# Altium schematic sheet 08-DcMotorEncoder.SchDoc
size A4
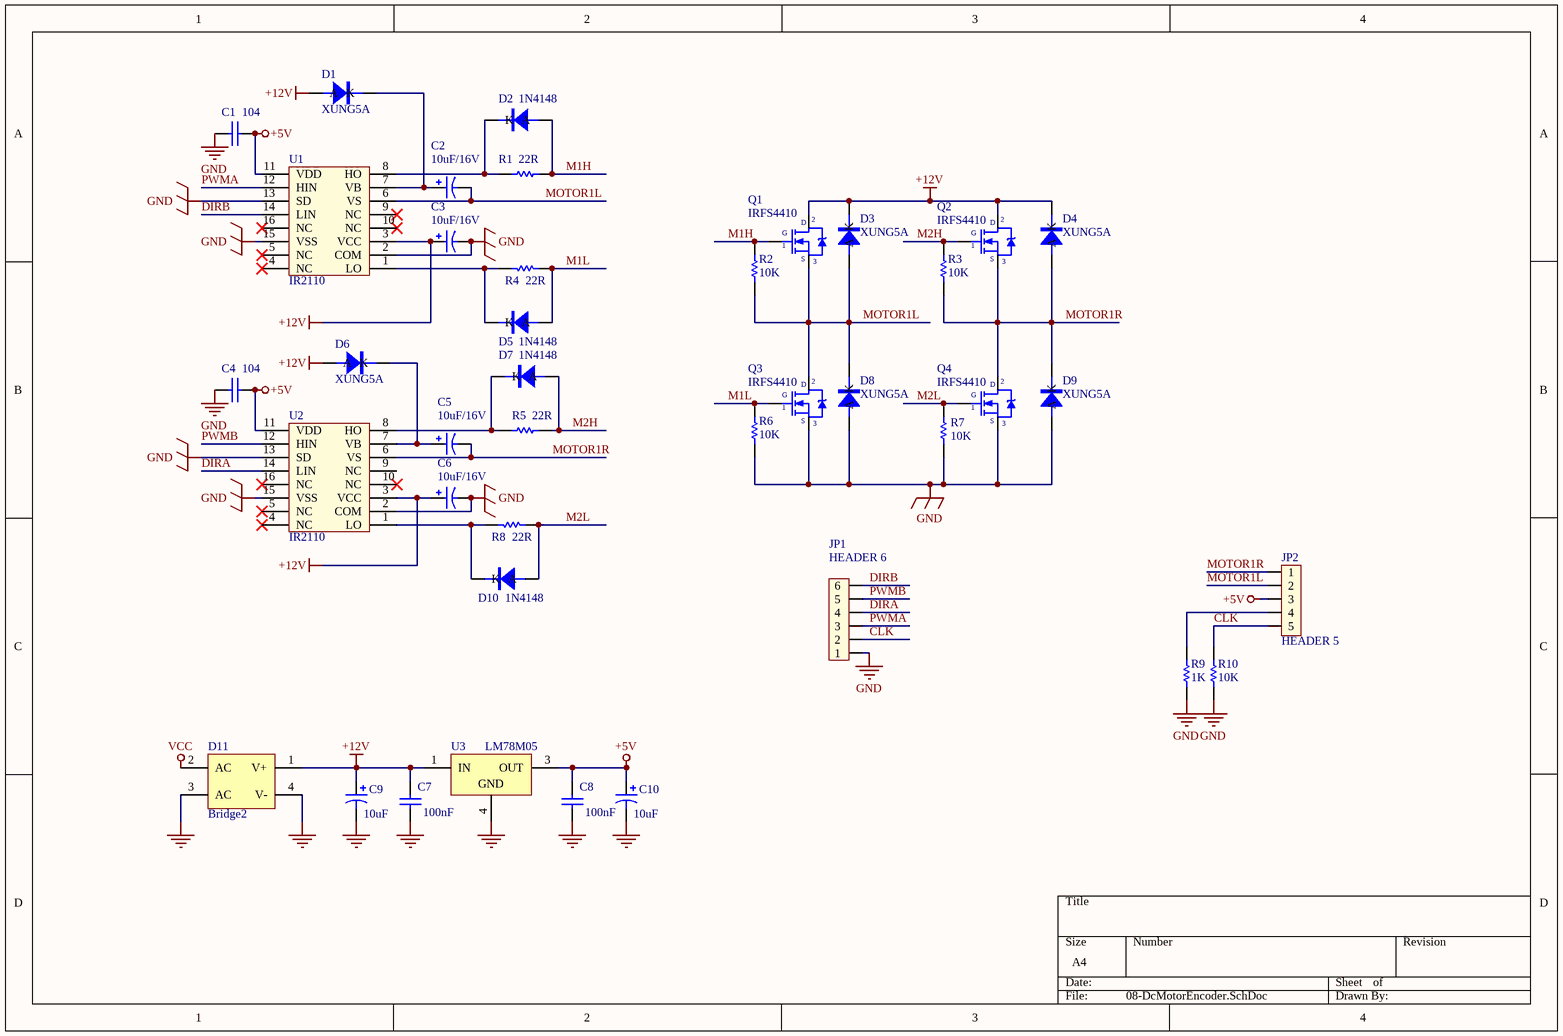
[diagram p0: 08-DcMotorEncoder.SchDoc]

## Parts
C1  104  [R-0805]
C2  value 10uF/16V  [C-TANT-1210]  (hidden comment: 10U16V)
C3  value 10uF/16V  [C-TANT-1210]  (hidden comment: 10U16V)
C4  104  [R-0805]
C5  value 10uF/16V  [C-TANT-1210]  (hidden comment: 10U16V)
C6  value 10uF/16V  [C-TANT-1210]  (hidden comment: 10U16V)
C7  value 100nF  [RAD-0.3]  (hidden comment: 104)
C8  value 100nF  [RAD-0.3]  (hidden comment: 104)
C9  value 10uF  [RB7.6-15]  (hidden comment: 10uF/16V)
C10  value 10uF  [RB7.6-15]  (hidden comment: 10uF/16V)
D1  value XUNG5A  [D-DO214-AC]  (hidden comment: 1N4007)
D2  1N4148  [D-DO213-AA]
D3  value XUNG5A  [D-DO214-AC]  (hidden comment: 1N4007)
D4  value XUNG5A  [D-DO214-AC]  (hidden comment: 1N4007)
D5  1N4148  [D-DO213-AA]
D6  value XUNG5A  [D-DO214-AC]  (hidden comment: 1N4007)
D7  1N4148  [D-DO213-AA]
D8  value XUNG5A  [D-DO214-AC]  (hidden comment: 1N4007)
D9  value XUNG5A  [D-DO214-AC]  (hidden comment: 1N4007)
D10  1N4148  [D-DO213-AA]
D11  Bridge2  [D-46_6A]
JP1  HEADER 6  [JP6]
JP2  HEADER 5  [CONN-XH2.54-5P]
Q1  IRFS4410  [TO-263-3]
Q2  IRFS4410  [TO-263-3]
Q3  IRFS4410  [TO-263-3]
Q4  IRFS4410  [TO-263-3]
R1  value 22R  [R-0805]  (hidden comment: 22)
R2  10K  [R-0805]
R3  10K  [R-0805]
R4  value 22R  [R-0805]  (hidden comment: 22)
R5  value 22R  [R-0805]  (hidden comment: 22)
R6  10K  [R-0805]
R7  10K  [R-0805]
R8  value 22R  [R-0805]  (hidden comment: 22)
R9  1K  [R-0805]
R10  value 10K  [R-0805]  (hidden comment: 1K)
U1  IR2110  [SOIC-16-W]
U2  IR2110  [SOIC-16-W]
U3  value LM78M05  [NDP0003B_M]  (hidden comment: LM78M05CDTX)

## Nets
+5V: C1.2 C4.2 C8.1 C10.1 JP2.3 U1.11(VDD) U2.11(VDD) U3.3(OUT)
+12V: C3.1 C6.1 C7.1 C9.1 D1.1(A) D3.2(K) D4.2(K) D6.1(A) D11.1(V+) Q1.2(D) Q2.2(D) U1.3(VCC) U2.3(VCC) U3.1(IN)
GND: C1.1 C3.2 C4.1 C6.2 C7.2 C8.2 C9.2 C10.2 D8.1(A) D9.1(A) D11.3(AC) D11.4(V-) JP1.1 Q3.3(S) Q4.3(S) R6.1 R7.1 R9.1 R10.1 U1.2(COM) U1.13(SD) U1.15(VSS) U2.2(COM) U2.13(SD) U2.15(VSS) U3.4(GND)
VCC: D11.2(AC)
CLK: JP1.2 JP2.5 R10.2
DIRA: JP1.4 U2.14(LIN)
DIRB: JP1.6 U1.14(LIN)
M1H: D2.1(A) Q1.1(G) R1.2 R2.2
M1L: D5.1(A) Q3.1(G) R4.2 R6.2
M2H: D7.1(A) Q2.1(G) R3.2 R5.2
M2L: D10.1(A) Q4.1(G) R7.2 R8.2
MOTOR1L: C2.2 D3.1(A) D8.2(K) JP2.2 Q1.3(S) Q3.2(D) R2.1 U1.6(VS)
MOTOR1R: C5.2 D4.1(A) D9.2(K) JP2.1 Q2.3(S) Q4.2(D) R3.1 U2.6(VS)
PWMA: JP1.3 U1.12(HIN)
PWMB: JP1.5 U2.12(HIN)
NetC2_1: C2.1 D1.2(K) U1.7(VB)
NetC5_1: C5.1 D6.2(K) U2.7(VB)
NetD2_2: D2.2(K) R1.1 U1.8(HO)
NetD5_2: D5.2(K) R4.1 U1.1(LO)
NetD7_2: D7.2(K) R5.1 U2.8(HO)
NetD10_2: D10.2(K) R8.1 U2.1(LO)
NetJP2_4: JP2.4 R9.2

Not connected (* = marked no-connect by the designer): U1 4(NC)* 5(NC)* 9(NC)* 10(NC)* 16(NC)*; U2 4(NC)* 5(NC)* 9(NC) 10(NC)* 16(NC)*

## Library data of the parts
C1 C4 = CAP NP: value: 104
C2 C3 C5 C6 = CAP POL
C7 C8 = Cap: Capacitor; Published: 8-Jun-2000; LatestRevisionDate: 17-Jul-2002; LatestRevisionNote: Re-released for DXP Platform.; PackageReference: RAD-0.3; Publisher: Altium Limited; PackageDescription: Radial Cap, Thru-Hole; 2 Leads; 0.3 in Pin Spacing
C9 C10 = Cap Pol1: Polarized Capacitor (Radial); Published: 8-Jun-2000; LatestRevisionDate: 17-Jul-2002; LatestRevisionNote: Re-released for DXP Platform.; PackageReference: RB7.6-15; Publisher: Altium Limited; PackageDescription: Polarized Capacitor (Radial); 2 Leads
D1-D10 = DIODE
  D2 D5 D7 D10: VALUE: 1N4148
D11 = Bridge2: Diode Bridge; Published: 24-Mar-1999; LatestRevisionDate: 17-Jul-2002; LatestRevisionNote: Re-released for DXP Platform.; PackageReference: D-46_6A; Publisher: Altium Limited; PackageDescription: Bridge Rectifier; 4 Terminals; Body 16.8 x 16.8 mm (typ); Pitch 10.67 mm
JP1 = JP6: JP6 PIN; Value: JP7
JP2 = JP5
R1-R10 = Res1: Resistor; Manufacturer: Generic Components; Class: Passive; Published: 08/06/2000; Publisher: Altium Hobart Technology Centre; SubClass: Resistor
  R2 R3 R6 R7: Value: 10K
  R9: Value: 1K
U3 = CMP-0062-00204-3: 3-Terminal Positive Voltage Regulators, 3-pin TO-252; Manufacturer: Texas Instruments; PackageTopMarking: NSUZXYTT*LM78M05*CDT; PowerWise: N; CompType: LDO IC; ComponentLink1Description: Datasheet URL; ComponentLink1URL: http://www.ti.com/general/docs/lit/getliterature.tsp?genericPartNumber=LM78M05&fileType=pdf; PackageReference: NDP0003B; Code_JEDEC: TO-252-AA; PinCount: 3; PackageDescription: TO252, Molded, Jedec, 6.8 x 6.10 x 2.30mm Body, 3 Lead, 2.28mm Pitch, Surface Mount
Q1-Q4 = IRFS4410: Value: IRFS4410
U1 U2 = IR2110: Value: IR2110